# EAGLE board soundpuddle_megawing_mk1 (EAGLE 6.2)
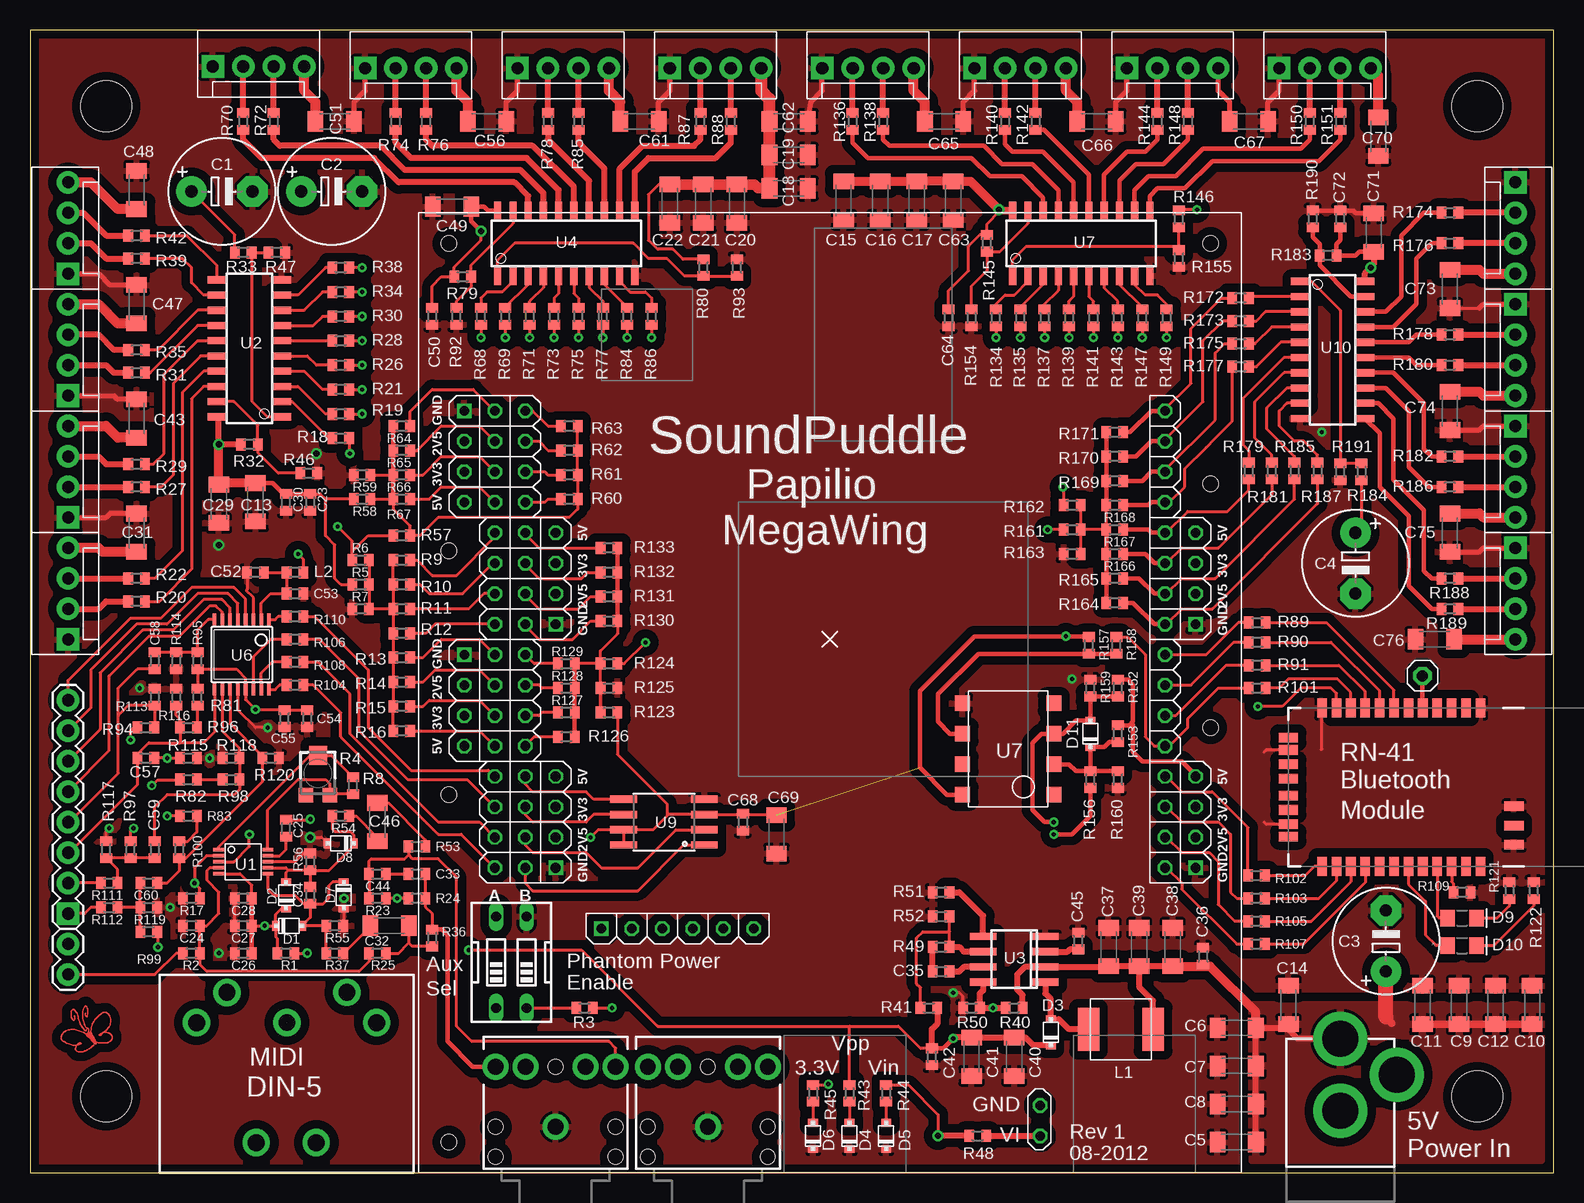
[diagram p3: board, top side]
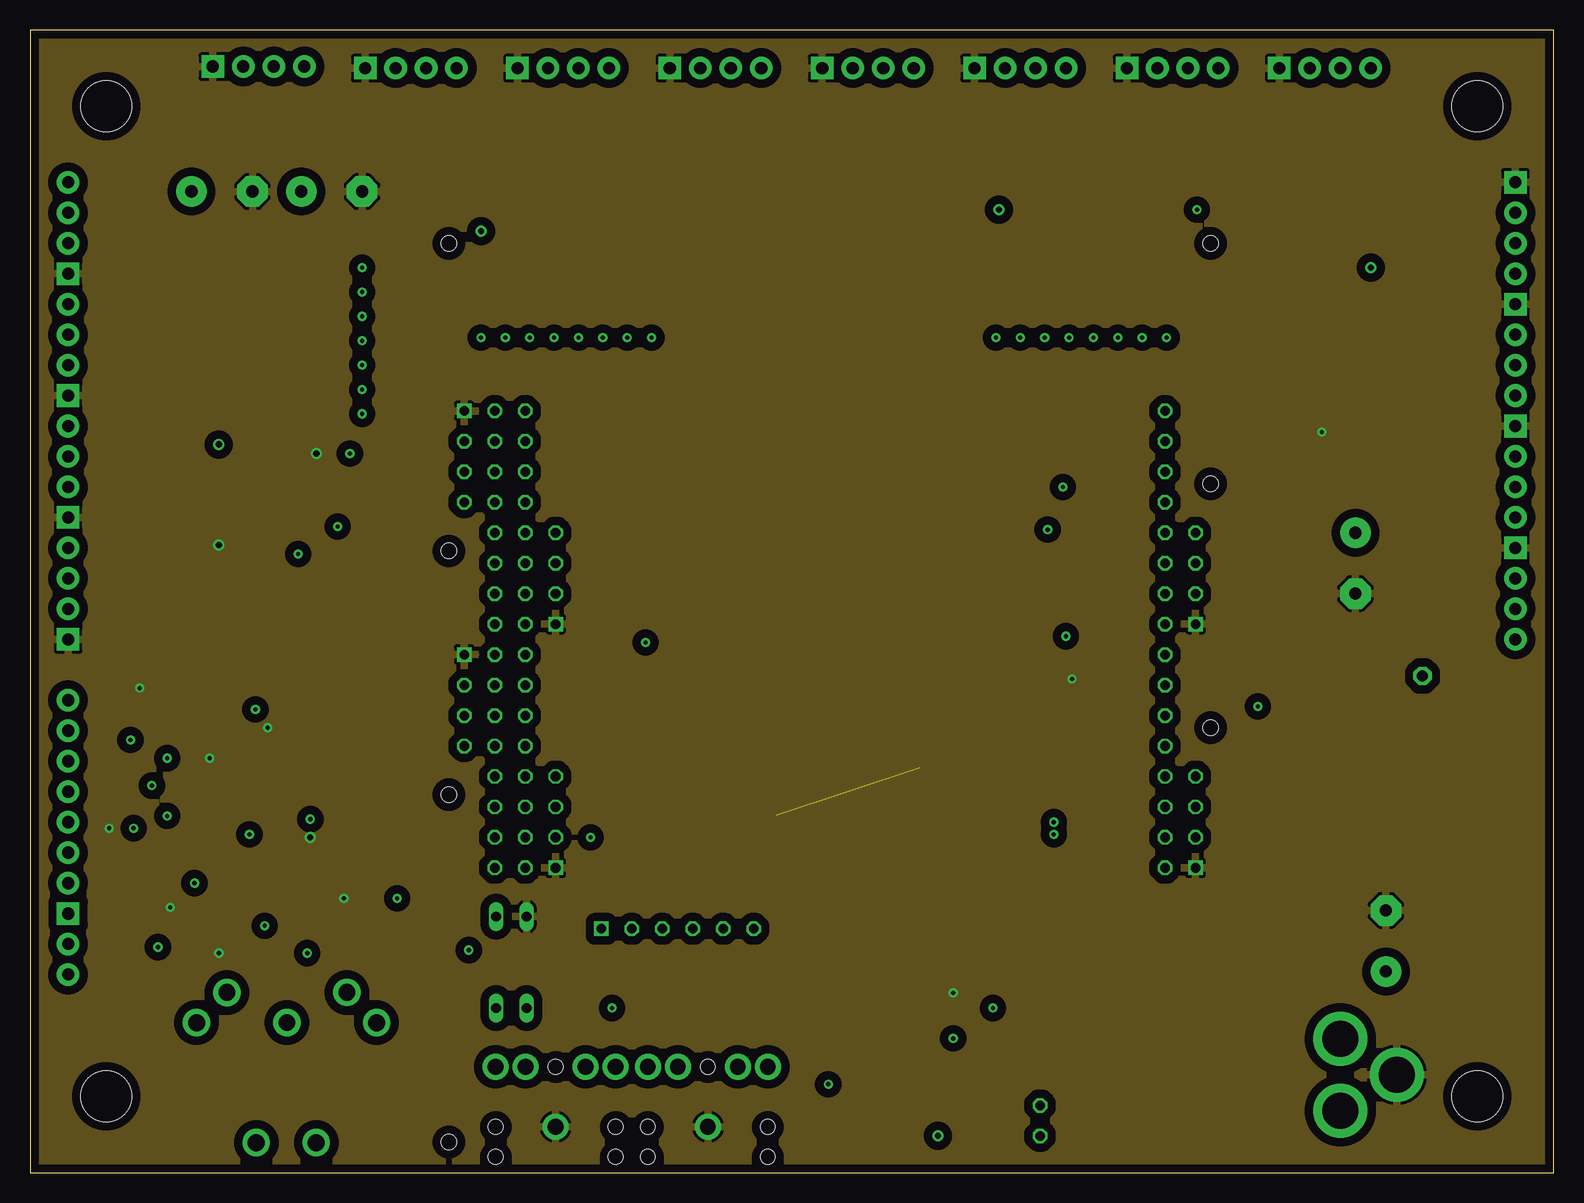
[diagram p4: board, inner layer Route2]
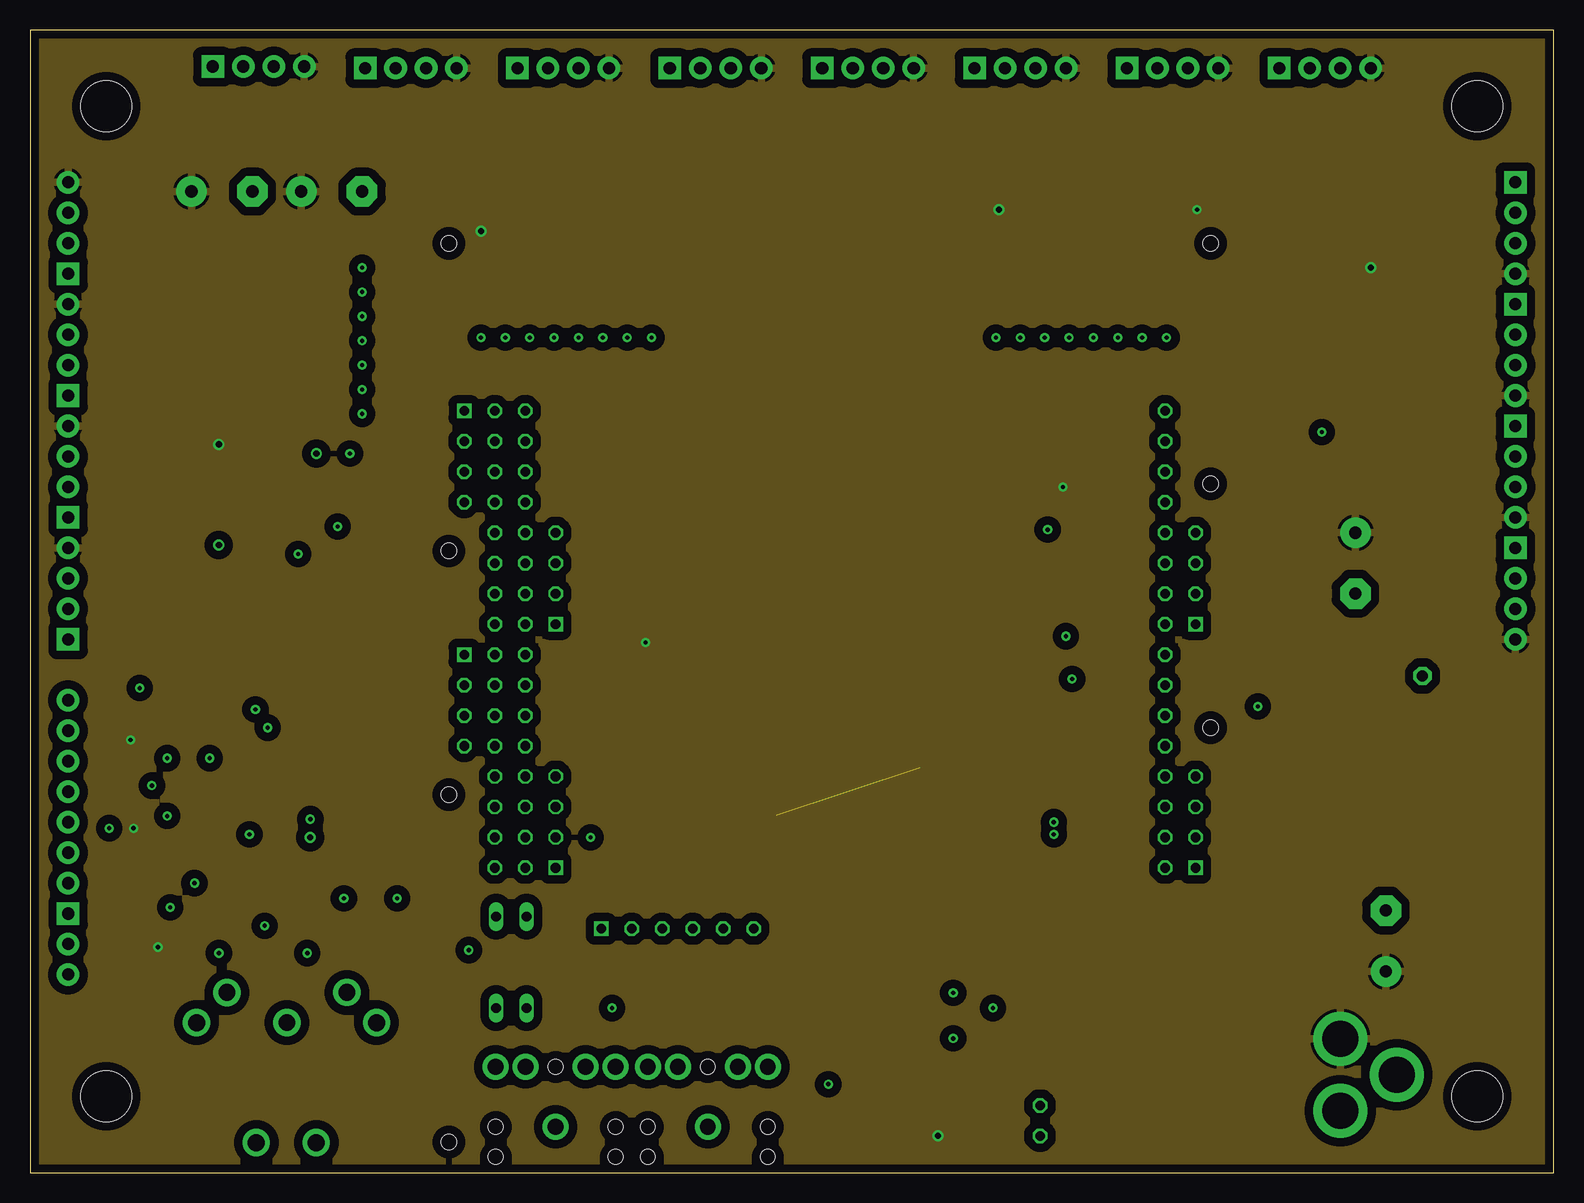
[diagram p5: board, inner layer Route15]
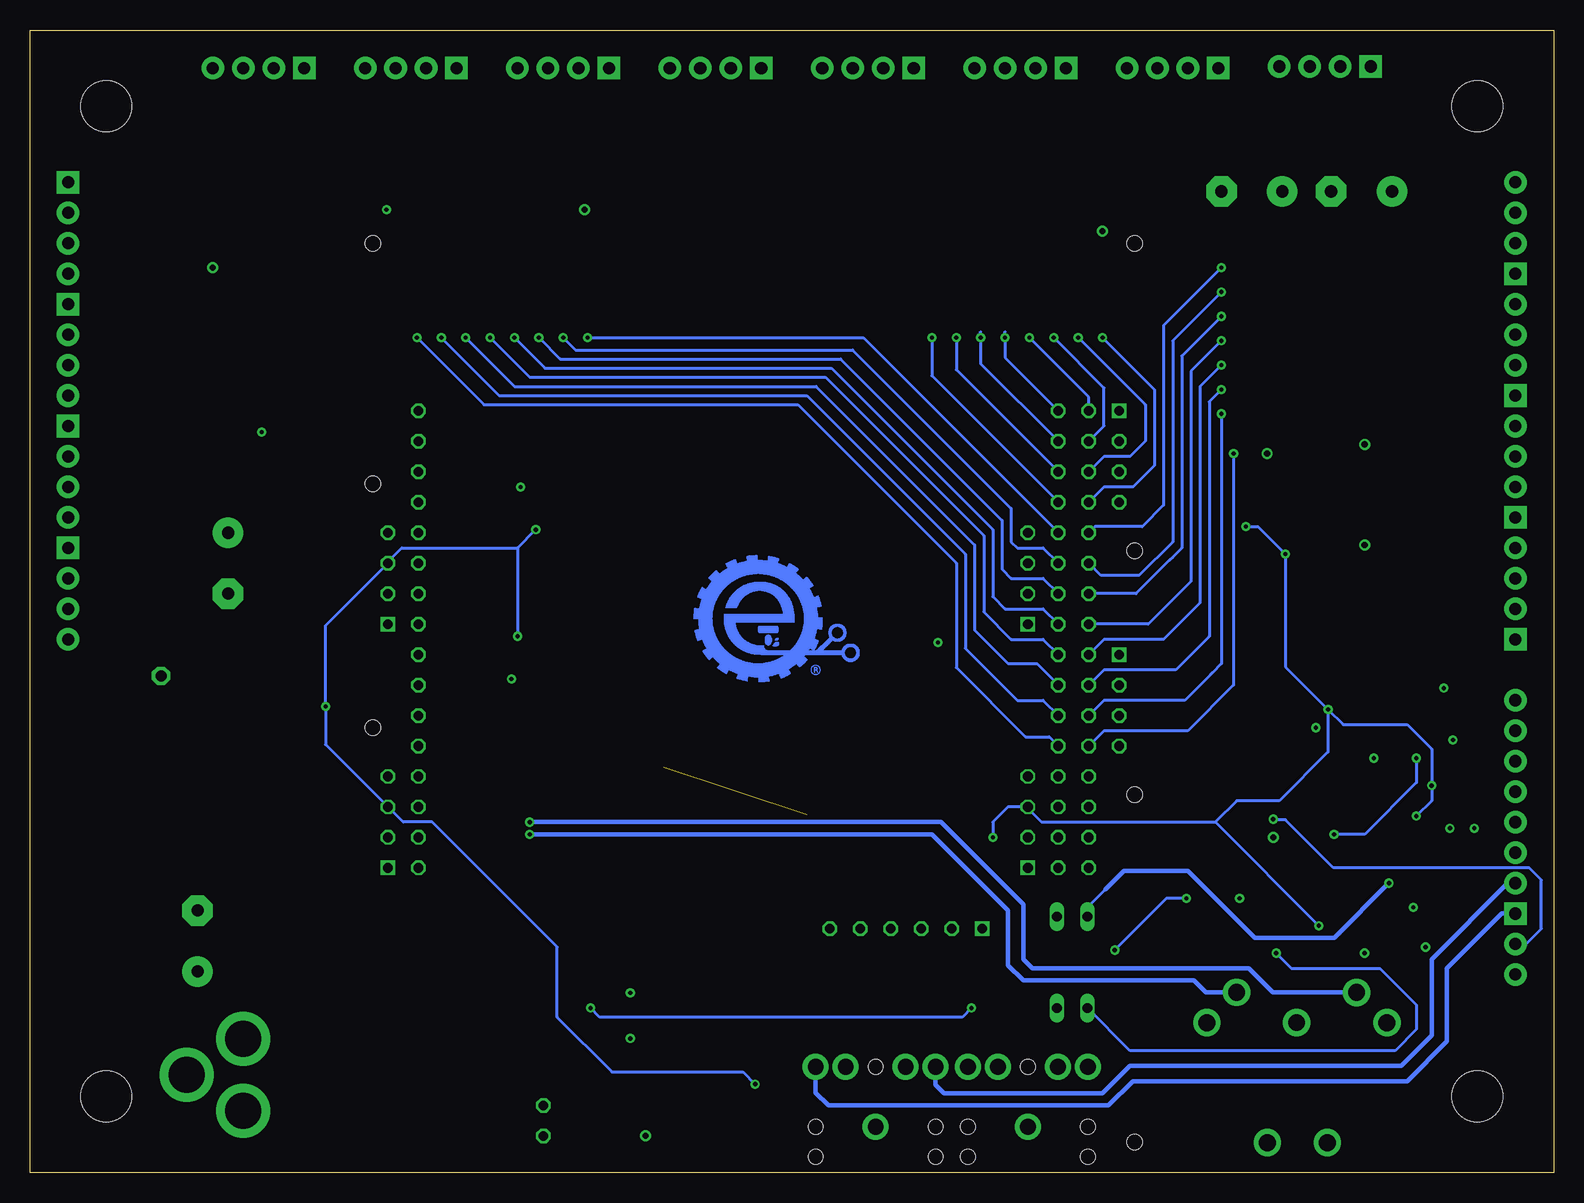
[diagram p6: board, bottom side, seen from below]

Size 127 x 95.25 mm. Coordinates in mm from the lower left corner, seen from the top.
Outline: 0,0 127,0 127,95.25 0,95.25 0,0
Copper layers (1+2*15+16): Top 0.0178mm / dielectric 12mil / Route2 0.0356mm / dielectric 28mil / Route15 0.0356mm / dielectric 12mil / Bottom 0.0178mm
Design rules: minimum track width 6mil, minimum drill 8mil, track to track 6mil, track to pad 6mil, pad to pad 6mil, via to via 6mil, smd to smd 6mil, copper to edge 20mil, drill to drill 16mil, minimum pad ring 8mil, minimum via ring 8mil, stop-mask expansion 3mil, vias tented up to drill 0mil, thermal gap 10mil
Holes 4.24 mm at 6.35,88.9 120.65,88.9 6.35,6.35 120.65,6.35

## Footprints (pad centres in the part's own frame; a part is rotated, then mirrored left to right if it is on the bottom)
E5-8,5 = drill 1.016 pad 2.54: + -2.54,0 | drill 1.016 pad 2.54 octagon: - 2.54,0
1206 = smd 1.3 x 1.7: P$1 -1.6,0; P$2 1.6,0
0603 = smd 0.8 x 1: 1 -0.7,0; 2 0.7,0
SOD-323 = smd 0.63 x 0.83: A 1.1,0; C -1.1,0
LED_0805 = smd 1.2 x 1.4: 1 -1.2,0; 2 1.2,0
POWER_JACK_PTH = drill 2.997 pad 4.318: GND 0,7.7; GNDBREAK 4.7,10.7; PWR 0,13.7
PAPILIO_PLUS = drill 0.8 octagon: A0 62.23,15.24; A1 62.23,17.78; A2 62.23,20.32; A3 62.23,22.86; A4 62.23,25.4; A5 62.23,27.94; A6 62.23,30.48; A7 62.23,33.02; A8 62.23,35.56; A9 62.23,38.1; A10 62.23,40.64; A11 62.23,43.18; A12 62.23,45.72; A13 62.23,48.26; A14 62.23,50.8; A15 62.23,53.34; B0 59.69,53.34; B1 59.69,50.8; B2 59.69,48.26; B3 59.69,45.72; B4 59.69,43.18; B5 59.69,40.64; B6 59.69,38.1; B7 59.69,35.56; B8 59.69,33.02; B9 59.69,30.48; B10 59.69,27.94; B11 59.69,25.4; B12 59.69,22.86; B13 59.69,20.32; B14 59.69,17.78; B15 59.69,15.24; C0 6.35,53.34; C1 6.35,50.8; C2 6.35,48.26; C3 6.35,45.72; C4 6.35,43.18; C5 6.35,40.64; C6 6.35,38.1; C7 6.35,35.56; C8 6.35,33.02; C9 6.35,30.48; C10 6.35,27.94; C11 6.35,25.4; C12 6.35,22.86; C13 6.35,20.32; C14 6.35,17.78; C15 6.35,15.24; GND 16.764,73.152; GND_2 50.8,58.42; TCK 48.26,58.42; TDI 43.18,58.42; TDO 45.72,58.42; TMS 40.64,58.42; VIN 16.764,75.692; W2_2V5 57.15,50.8; W2_2V5_2 64.77,38.1; W2_2V5_3 57.15,30.48; W2_2V5_4 64.77,17.78; W2_3V3 57.15,48.26; W2_3V3_2 64.77,40.64; W2_3V3_3 57.15,27.94; W2_3V3_4 64.77,20.32; W2_5V 57.15,45.72; W2_5V_2 64.77,43.18; W2_5V_3 57.15,25.4; W2_5V_4 64.77,22.86; W3_2V5 3.81,50.8; W3_2V5_2 3.81,30.48; W3_3V3 3.81,48.26; W3_3V3_2 3.81,27.94; W3_5V 3.81,45.72; W3_5V_2 3.81,25.4 | drill 0.8 square: REF 53.34,58.42; W2_GND 57.15,53.34; W2_GND_2 64.77,35.56; W2_GND_3 57.15,33.02; W2_GND_4 64.77,15.24; W3_GND 3.81,53.34; W3_GND_2 3.81,33.02 | hole 1.27: 66.04,76.2; 2.54,1.27; 66.04,1.27; 66.04,26.924; 66.04,47.244; 2.54,21.336; 2.54,41.656
1X02 = drill 1.016 pad 1.88: 1 0,0; 2 2.54,0
MOLEX-1X4 = drill 1.016 pad 1.88 square: 1 0,0 | drill 1.016 pad 1.88: 2 2.54,0; 3 5.08,0; 4 7.62,0
HEADER-SMALL-1PIN-0.036IN = drill 0.914 pad 1.524 octagon: P$1 0,0
AUDIO-JACK = drill 1.3 pad 2.184: RING 5,5; RSH 5,2.5; SLEEVE 0,0; TIP 5,-5; TSH 5,-2.5 | hole 1.2: 0,5; -2.5,5; -2.5,-5; 0,-5; 5,0
1X08 = drill 1.016 pad 1.88 square: 1 0,0 | drill 1.016 pad 1.88: 2 2.54,0; 3 5.08,0; 4 7.62,0; 5 10.16,0; 6 12.7,0; 7 15.24,0; 8 17.78,0
DIN_5_FEMALE_SUPPORT = drill 1.4 pad 2.286: 1 0.46,3.61; 2 -7.07,3.6; 3 7.94,3.6; 4 -4.53,6.12; 5 5.47,6.13; 6 -2.1,-6.4; 7 2.9,-6.4
INDUCTOR_10X10MM = smd 1.803 x 3.607: P$1 -2.692,0; P$2 2.692,0
TC33X = smd 1.2 x 1.2: 1 -1,-1.825; 3 1,-1.825 | smd 1.5 x 1.6: 2 0,1.5
DIPSWITCH-02 = drill 0.813 long: 1 -1.27,-3.81; 2 1.27,-3.81; 3 1.27,3.81; 4 -1.27,3.81
MSOP10 = smd 0.305 x 0.889: P$1 -1,-2.045; P$2 -0.5,-2.045; P$3 0,-2.045; P$4 0.5,-2.045; P$5 1,-2.045; P$6 1,2.045; P$7 0.5,2.045; P$8 0,2.045; P$9 -0.5,2.045; P$10 -1,2.045
SOIC-20 = smd 0.6 x 1.55: 1 -5.715,-2.7; 2 -4.445,-2.7; 3 -3.175,-2.7; 4 -1.905,-2.7; 5 -0.635,-2.7; 6 0.635,-2.7; 7 1.905,-2.7; 8 3.175,-2.7; 9 4.445,-2.7; 10 5.715,-2.7; 11 5.715,2.7; 12 4.445,2.7; 13 3.175,2.7; 14 1.905,2.7; 15 0.635,2.7; 16 -0.635,2.7; 17 -1.905,2.7; 18 -3.175,2.7; 19 -4.445,2.7; 20 -5.715,2.7
SO8 = smd 0.6 x 2.2: 1 -1.905,-2.6; 2 -0.635,-2.6; 3 0.635,-2.6; 4 1.905,-2.6; 5 1.905,2.6; 6 0.635,2.6; 7 -0.635,2.6; 8 -1.905,2.6
RN41 = smd 0.8 x 1.6: 1 -6.6,-6.6; 2 -5.4,-6.6; 3 -4.2,-6.6; 4 -3,-6.6; 5 -1.8,-6.6; 6 -0.6,-6.6; 7 0.6,-6.6; 8 1.8,-6.6; 9 3,-6.6; 10 4.2,-6.6; 11 5.4,-6.6; 12 6.6,-6.6; 13 6.6,6.6; 14 5.4,6.6; 15 4.2,6.6; 16 3,6.6; 17 1.8,6.6; 18 0.6,6.6; 19 -0.6,6.6; 20 -1.8,6.6; 21 -3,6.6; 22 -4.2,6.6; 23 -5.4,6.6; 24 -6.6,6.6 | smd 1.6 x 0.8: 25 -9.4,4.8; 26 -9.4,3.2; 27 -9.4,1.6; 28 9.4,3.1; 29 9.4,-3.1; 30 9.4,-4.122; 31 9.4,-1.9; 32 9.4,-0.7; 33 9.4,0.7; 34 9.4,1.9; 35 9.4,4.122
TSSOP16 = smd 0.305 x 0.991: 1 -2.275,-2.918; 2 -1.625,-2.918; 3 -0.975,-2.918; 4 -0.325,-2.918; 5 0.325,-2.918; 6 0.975,-2.918; 7 1.625,-2.918; 8 2.275,-2.918; 9 2.275,2.918; 10 1.625,2.918; 11 0.975,2.918; 12 0.325,2.918; 13 -0.325,2.918; 14 -0.975,2.918; 15 -1.625,2.918; 16 -2.275,2.918
SMD-8 = smd 1.27 x 1.27: P$1 -3.81,-3.81; P$2 -1.27,-3.81; P$3 1.27,-3.81; P$4 3.81,-3.81; P$5 3.81,3.81; P$6 1.27,3.81; P$7 -1.27,3.81; P$8 -3.81,3.81
SO08-EIAJ = smd 0.61 x 2.21: 1 -1.905,-3.378; 2 -0.635,-3.378; 3 0.635,-3.378; 4 1.905,-3.378; 5 1.905,3.353; 6 0.635,3.353; 7 -0.635,3.353; 8 -1.905,3.353

## Placement (x,y rotation side)
C1  1mF  [E5-8,5]  16,81.79 0 top
C2  1mF  [E5-8,5]  25.15,81.79 0 top
C3  1mF  [E5-8,5]  113.03,19.3 90 top
C4  1mF  [E5-8,5]  110.49,50.8 270 top
C5  47uF  [1206]  100.58,2.54 180 top
C6  47uF  [1206]  100.58,12.06 180 top
C7  47uF  [1206]  100.58,8.89 180 top
C8  47uF  [1206]  100.58,5.71 180 top
C9  47uF  [1206]  119.13,13.97 90 top
C10  47uF  [1206]  125.22,13.97 90 top
C11  47uF  [1206]  116.08,13.97 90 top
C12  47uF  [1206]  122.17,13.97 90 top
C13  47uF  [1206]  18.8,55.88 270 top
C14  47uF  [1206]  104.9,13.97 90 top
C15  47uF  [1206]  67.82,81.03 270 top
C16  47uF  [1206]  70.87,81.03 270 top
C17  47uF  [1206]  73.91,81.03 270 top
C18  47uF  [1206]  63.25,82.04 0 top
C19  47uF  [1206]  63.25,84.84 0 top
C20  47uF  [1206]  58.93,80.77 270 top
C21  47uF  [1206]  56.13,80.77 270 top
C22  47uF  [1206]  53.34,80.77 270 top
C23  0.1uF  [0603]  23.37,55.88 270 top
C24  470p  [0603]  13.46,20.57 180 top
C25  10uF  [0603]  21.34,28.7 270 top
C26  1uF  [0603]  17.78,18.29 180 top
C27  1uF  [0603]  17.78,20.57 180 top
C28  0.1uF  [0603]  17.78,22.86 180 top
C29  100uF  [1206]  15.75,55.75 270 top
C30  1uF  [0603]  21.34,55.88 270 top
C31  47uF  [1206]  8.89,53.34 270 top
C32  47uF  [1206]  29.97,20.57 180 top
C33  100p  [0603]  32.26,24.89 180 top
C34  470p  [0603]  23.37,23.11 90 top
C35  1uF  [0603]  75.95,16.76 180 top
C36  DNP  [0603]  97.79,18.03 90 top
C37  47uF  [1206]  89.92,18.8 90 top
C38  47uF  [1206]  95.25,18.8 90 top
C39  47uF  [1206]  92.46,18.8 90 top
C40  100uF  [1206]  82.04,9.65 270 top
C41  100uF  [1206]  78.49,9.65 270 top
C42  1uF  [0603]  75.18,9.65 270 top
C43  47uF  [1206]  8.89,62.87 270 top
C44  100p  [0603]  28.96,24.89 180 top
C45  1uF  [0603]  87.38,19.3 90 top
C46  47uF  [1206]  28.96,29.21 270 top
C47  47uF  [1206]  8.89,72.39 270 top
C48  47uF  [1206]  8.89,81.92 270 top
C49  100uF  [1206]  35.18,80.52 180 top
C50  1uF  [0603]  33.53,71.37 270 top
C51  47uF  [1206]  25.4,87.63 180 top
C52  0.1uF  [0603]  18.8,50.04 180 top
C53  1uF  [0603]  22.1,48.26 0 top
C54  0.1uF  [0603]  23.11,37.85 270 top
C55  1uF  [0603]  21.21,37.85 270 top
C56  47uF  [1206]  38.1,87.63 180 top
C57  10uF  [0603]  9.65,34.54 180 top
C58  1uF  [0603]  10.41,42.67 90 top
C59  10uF  [0603]  10.41,26.92 90 top
C60  10uF  [0603]  9.91,24.13 0 top
C61  47uF  [1206]  50.8,87.63 180 top
C62  47uF  [1206]  63.25,87.63 180 top
C63  100uF  [1206]  76.96,81.03 270 top
C64  1uF  [0603]  76.58,71.25 270 top
C65  47uF  [1206]  76.2,87.63 180 top
C66  47uF  [1206]  88.9,87.63 180 top
C67  47uF  [1206]  101.6,87.63 180 top
C68  1uF  [0603]  59.44,29.21 270 top
C69  DNP  [1206]  62.23,28.19 270 top
C70  47uF  [1206]  112.39,86.36 90 top
C71  100uF  [1206]  112.01,78.36 90 top
C72  1uF  [0603]  109.22,79.5 90 top
C73  47uF  [1206]  118.36,73.66 90 top
C74  47uF  [1206]  118.36,63.5 90 top
C75  47uF  [1206]  118.36,53.34 90 top
C76  47uF  [1206]  117.09,44.45 0 top
D1  [SOD-323]  21.59,20.57 0 top
D2  [SOD-323]  21.34,23.11 90 top
D3  [SOD-323]  85.09,11.68 90 top
D4  [SOD-323]  68.33,3.05 90 top
D5  [SOD-323]  71.37,3.05 90 top
D6  [SOD-323]  65.28,3.05 90 top
D7  [SOD-323]  26.16,23.11 270 top
D8  [SOD-323]  25.91,27.43 180 top
D9  [LED_0805]  119.38,21.21 0 top
D10  [LED_0805]  119.38,18.92 0 top
D11  [SOD-323]  88.39,36.58 90 top
J1  POWER_JACKPTH  [POWER_JACK_PTH]  109.22,-2.54 0 top
JP1  PAPILIO_PLUS_MEGAWING  [PAPILIO_PLUS]  100.97,78.74 180 top
JP2  [1X02]  3.17,19.05 270 top
JP3  [MOLEX-1X4]  3.17,44.45 90 top
JP4  HEADER-SMALL-1PIN  [HEADER-SMALL-1PIN-0.036IN]  116.08,41.4 0 top
JP5  AUDIO-JACK2PTH  [AUDIO-JACK]  43.81,3.81 90 top
JP6  [MOLEX-1X4]  3.17,54.61 90 top
JP7  [MOLEX-1X4]  3.17,64.77 90 top
JP8  [MOLEX-1X4]  3.17,74.93 90 top
JP9  [MOLEX-1X4]  15.24,92.2 0 top
JP10  [MOLEX-1X4]  27.94,92.08 0 top
JP11  [1X08]  3.17,21.59 90 top
JP12  [MOLEX-1X4]  40.64,92.08 0 top
JP13  [MOLEX-1X4]  53.34,92.08 0 top
JP14  AUDIO-JACK2PTH  [AUDIO-JACK]  56.52,3.81 90 top
JP15  [MOLEX-1X4]  66.04,92.08 0 top
JP16  [MOLEX-1X4]  78.74,92.08 0 top
JP17  MIDI_CONN_FEMALE_SUPPORT  [DIN_5_FEMALE_SUPPORT]  20.95,8.89 0 top
JP18  [MOLEX-1X4]  91.44,92.08 0 top
JP19  [MOLEX-1X4]  104.14,92.08 0 top
JP20  [MOLEX-1X4]  123.83,82.55 270 top
JP21  [MOLEX-1X4]  123.83,72.39 270 top
JP22  [MOLEX-1X4]  123.83,62.23 270 top
JP23  [MOLEX-1X4]  123.83,52.07 270 top
L1  330uH  [INDUCTOR_10X10MM]  90.93,11.94 180 top
L2  [0603]  22.1,50.04 180 top
LOGO1  LOGO  [LOGO]  72.39,40.39 0 bottom
R1  2.2K  [0603]  21.34,18.29 180 top
R2  2.2K  [0603]  13.46,18.29 0 top
R3  100  [0603]  46.23,13.72 0 top
R4  [TC33X]  24,33.27 0 top
R5  DNP  [0603]  27.56,49.02 0 top
R6  DNP  [0603]  27.56,51.05 0 top
R7  0  [0603]  27.56,46.99 0 top
R8  10K  [0603]  26.92,32.26 270 top
R9  2.2K  [0603]  30.99,51.05 0 top
R10  2.2K  [0603]  30.99,49.02 0 top
R11  2.2K  [0603]  30.99,46.99 0 top
R12  2.2K  [0603]  30.99,44.96 0 top
R13  2.2K  [0603]  30.99,42.93 0 top
R14  2.2K  [0603]  30.99,40.89 0 top
R15  2.2K  [0603]  30.99,38.86 0 top
R16  2.2K  [0603]  30.99,36.83 0 top
R17  10K  [0603]  13.46,22.86 0 top
R18  22  [0603]  25.91,61.21 180 top
R19  22  [0603]  25.91,63.25 180 top
R20  22  [0603]  8.89,47.62 180 top
R21  22  [0603]  25.91,65.28 180 top
R22  22  [0603]  8.89,49.53 180 top
R23  6.8K  [0603]  28.96,22.86 0 top
R24  6.8K  [0603]  32.26,22.86 180 top
R25  DNP  [0603]  28.96,18.29 180 top
R26  22  [0603]  25.91,67.31 180 top
R27  22  [0603]  8.89,57.15 180 top
R28  22  [0603]  25.91,69.34 180 top
R29  22  [0603]  8.89,59.05 180 top
R30  22  [0603]  25.91,71.37 180 top
R31  22  [0603]  8.89,66.67 180 top
R32  DNP  [0603]  18.29,60.71 180 top
R33  DNP  [0603]  17.78,76.71 180 top
R34  22  [0603]  25.91,73.41 180 top
R35  22  [0603]  8.89,68.58 180 top
R36  1K  [0603]  33.53,19.56 270 top
R37  10  [0603]  25.4,18.29 180 top
R38  22  [0603]  25.91,75.44 180 top
R39  22  [0603]  8.89,76.2 180 top
R40  2.2K  [0603]  82.04,13.72 0 top
R41  54.9K  [0603]  74.93,13.72 0 top
R42  22  [0603]  8.89,78.11 180 top
R43  10K  [0603]  68.33,6.6 90 top
R44  2.2K  [0603]  71.37,6.6 90 top
R45  2.2K  [0603]  65.28,6.6 90 top
R46  2.2K  [0603]  23.24,58.29 180 top
R47  2.2K  [0603]  20.57,76.71 180 top
R48  DNP  [0603]  78.99,3.05 0 top
R49  390  [0603]  75.95,18.8 0 top
R50  DNP  [0603]  78.49,13.72 0 top
R51  52.3K  [0603]  75.95,23.37 0 top
R52  1.47K  [0603]  75.95,21.34 0 top
R53  1K  [0603]  32.26,27.18 0 top
R54  10  [0603]  25.91,29.72 180 top
R55  1K  [0603]  25.4,20.57 180 top
R56  1K  [0603]  23.37,25.91 270 top
R57  0  [0603]  30.99,53.09 180 top
R58  DNP  [0603]  27.69,56.13 180 top
R59  DNP  [0603]  27.69,58.17 180 top
R60  2.2K  [0603]  44.96,56.13 0 top
R61  2.2K  [0603]  44.96,58.17 0 top
R62  2.2K  [0603]  44.96,60.2 0 top
R63  2.2K  [0603]  44.96,62.23 0 top
R64  2.2K  [0603]  30.99,62.23 180 top
R65  2.2K  [0603]  30.99,60.2 180 top
R66  2.2K  [0603]  30.99,58.17 180 top
R67  2.2K  [0603]  30.99,56.13 180 top
R68  22  [0603]  37.59,71.37 90 top
R69  22  [0603]  39.62,71.37 90 top
R70  22  [0603]  17.78,87.63 90 top
R71  22  [0603]  41.66,71.37 90 top
R72  22  [0603]  20.32,87.63 90 top
R73  22  [0603]  43.69,71.37 90 top
R74  22  [0603]  30.48,87.63 90 top
R75  22  [0603]  45.72,71.37 90 top
R76  22  [0603]  33.02,87.63 90 top
R77  22  [0603]  47.75,71.37 90 top
R78  22  [0603]  43.18,87.63 90 top
R79  DNP  [0603]  36.07,74.68 180 top
R80  DNP  [0603]  56.13,75.44 90 top
R81  DNP  [0603]  13.97,39.62 90 top
R82  100K  [0603]  13.21,32.77 180 top
R83  100K  [0603]  13.21,29.72 180 top
R84  22  [0603]  49.78,71.37 90 top
R85  22  [0603]  45.72,87.63 90 top
R86  22  [0603]  51.82,71.37 90 top
R87  22  [0603]  55.88,87.63 90 top
R88  22  [0603]  58.42,87.63 90 top
R89  10  [0603]  102.3,45.85 180 top
R90  10  [0603]  102.3,44.2 180 top
R91  10  [0603]  102.3,42.29 180 top
R92  2.2K  [0603]  35.56,71.37 90 top
R93  2.2K  [0603]  58.93,75.44 270 top
R94  DNP  [0603]  9.65,37.08 180 top
R95  DNP  [0603]  13.97,42.67 270 top
R96  DNP  [0603]  13.21,37.08 0 top
R97  DNP  [0603]  8.38,26.92 90 top
R98  10K  [0603]  16.76,32.77 180 top
R99  DNP  [0603]  9.91,20.07 0 top
R100  10K  [0603]  12.45,26.92 90 top
R101  10  [0603]  102.3,40.39 180 top
R102  10  [0603]  102.23,24.77 180 top
R103  10  [0603]  102.23,22.86 180 top
R104  50  [0603]  22.1,40.64 0 top
R105  10  [0603]  102.23,20.95 180 top
R106  50  [0603]  22.1,44.45 0 top
R107  10  [0603]  102.23,19.05 180 top
R108  50  [0603]  22.1,42.55 0 top
R109  330  [0603]  119.38,23.37 180 top
R110  50  [0603]  22.1,46.35 0 top
R111  10  [0603]  6.6,24.13 0 top
R112  10  [0603]  6.6,22.1 0 top
R113  DNP  [0603]  10.41,39.62 270 top
R114  DNP  [0603]  12.19,42.67 90 top
R115  DNP  [0603]  13.21,34.54 180 top
R116  DNP  [0603]  12.19,39.62 270 top
R117  DNP  [0603]  6.35,26.92 270 top
R118  100K  [0603]  16.76,34.54 0 top
R119  DNP  [0603]  9.91,22.1 180 top
R120  100K  [0603]  20.07,34.54 180 top
R121  330  [0603]  123.32,23.5 270 top
R122  330  [0603]  125.35,23.5 270 top
R123  0  [0603]  48.26,38.35 0 top
R124  DNP  [0603]  48.26,42.42 0 top
R125  DNP  [0603]  48.26,40.39 0 top
R126  2.2K  [0603]  44.7,36.32 0 top
R127  2.2K  [0603]  44.7,38.35 0 top
R128  2.2K  [0603]  44.7,40.39 0 top
R129  2.2K  [0603]  44.7,42.42 0 top
R130  2.2K  [0603]  48.26,45.97 0 top
R131  2.2K  [0603]  48.26,48.01 0 top
R132  2.2K  [0603]  48.26,50.04 0 top
R133  2.2K  [0603]  48.26,52.07 0 top
R134  22  [0603]  80.52,71.25 90 top
R135  22  [0603]  82.55,71.25 90 top
R136  22  [0603]  68.58,87.63 90 top
R137  22  [0603]  84.58,71.25 90 top
R138  22  [0603]  71.12,87.63 90 top
R139  22  [0603]  86.61,71.25 90 top
R140  22  [0603]  81.28,87.63 90 top
R141  22  [0603]  88.65,71.25 90 top
R142  22  [0603]  83.82,87.63 90 top
R143  22  [0603]  90.68,71.25 90 top
R144  22  [0603]  93.98,87.63 90 top
R145  DNP  [0603]  79.76,77.47 90 top
R146  DNP  [0603]  95.76,79.5 90 top
R147  22  [0603]  92.71,71.25 90 top
R148  22  [0603]  96.52,87.63 90 top
R149  22  [0603]  94.74,71.25 90 top
R150  22  [0603]  106.68,87.63 90 top
R151  22  [0603]  109.22,87.63 90 top
R152  330  [0603]  90.68,40.39 90 top
R153  330  [0603]  90.68,36.58 90 top
R154  2.2K  [0603]  78.49,71.25 90 top
R155  2.2K  [0603]  95.76,76.2 90 top
R156  220  [0603]  88.39,32.77 90 top
R157  220  [0603]  88.27,43.94 90 top
R158  390  [0603]  90.55,43.94 90 top
R159  330  [0603]  88.39,40.39 270 top
R160  330  [0603]  90.68,32.77 90 top
R161  0  [0603]  86.87,53.59 180 top
R162  DNP  [0603]  86.87,55.63 180 top
R163  DNP  [0603]  86.87,51.56 180 top
R164  100  [0603]  90.42,47.5 180 top
R165  100  [0603]  90.42,49.53 180 top
R166  100  [0603]  90.42,51.56 180 top
R167  100  [0603]  90.42,53.59 180 top
R168  100  [0603]  90.42,55.63 180 top
R169  100  [0603]  90.42,57.66 180 top
R170  100  [0603]  90.42,59.69 180 top
R171  100  [0603]  90.42,61.72 180 top
R172  22  [0603]  100.9,72.9 0 top
R173  22  [0603]  100.9,70.99 0 top
R174  100  [0603]  118.36,80.01 0 top
R175  22  [0603]  100.9,69.09 0 top
R176  100  [0603]  118.36,77.47 0 top
R177  22  [0603]  100.9,67.18 0 top
R178  100  [0603]  118.36,69.85 0 top
R179  100  [0603]  101.6,58.48 90 top
R180  100  [0603]  118.36,67.31 0 top
R181  100  [0603]  103.5,58.48 90 top
R182  100  [0603]  118.36,59.69 0 top
R183  DNP  [0603]  108.2,76.45 0 top
R184  DNP  [0603]  111,58.42 270 top
R185  100  [0603]  105.41,58.48 90 top
R186  100  [0603]  118.36,57.15 0 top
R187  100  [0603]  107.31,58.48 90 top
R188  100  [0603]  118.36,49.53 0 top
R189  100  [0603]  118.36,46.99 0 top
R190  2.2K  [0603]  106.93,79.5 270 top
R191  2.2K  [0603]  109.22,58.42 90 top
SW1  [DIPSWITCH-02]  40.13,17.53 0 top
U1  MAX4062  [MSOP10]  17.78,25.91 270 top
U2  SN74HCT541SOIC-20  [SOIC-20]  18.29,68.71 90 top
U3  LM5002  [SO8]  82.04,17.78 90 top
U4  SN74HCT541SOIC-20  [SOIC-20]  44.7,77.47 0 top
U5  BLUETOOTH-RN41"  [RN41]  114.3,32.13 180 top
U6  ADC128S102  [TSSOP16]  17.65,43.18 180 top
U7  SN74HCT541SOIC-20  [SOIC-20]  87.63,77.47 0 top
U8  6N138SMD8  [SMD-8]  81.53,35.31 90 top
U9  FLASH-SPI-25XXSMD1  [SO08-EIAJ]  52.83,29.21 90 top
U10  SN74HCT541SOIC-20  [SOIC-20]  108.58,68.58 270 top
U$4  [BUTTERFLY_LOGO_ON_COPPER]  4.83,11.43 0 top

## Tracks (layer width: path | path; a pad name or v marks a point on that pad's centre or on a via)
+3V3  (via drill 0.36)  (1 unrouted)
  Top 0.254: U9.7 U9.8 | 53.09,29.72 53.21,29.84 U9.3 59.37,29.84 C68.1 59.55,29.79 C69.P$1 | 53.09,29.72 51.94,28.57 U9.7 | U1.P$5 17.51,24.91 18.48,23.94 C28.1 | D1.C 20.49,19.64 20.64,19.5 R1.2 | C27.1 v19.56,20.57 D1.C | D1.C 20.49,21.51 21,22.01 D2.C | R57.2 28.19,53.09 26.86,51.75 R6.1 26.86,52.64 v25.65,53.85 | U9.7 47.37,28.57 v46.74,27.94 | C54.1 C55.1 18.86,38.55 v18.8,38.61 17.98,39.43 U6.13 17.98,41.2 17.21,41.97 R95.2 R81.2 | U5.11 108.9,39.94 108.46,40.39 105.92,40.39 104.39,38.86 v102.36,38.86 | R83.2 v11.43,29.72 | R161.2 v84.84,53.59 | L2.1 22.8,51.12 v22.35,51.56 | 12.45,32.7 10.61,32.7 v10.16,32.26 | R123.2 48.96,34.86 53.09,30.73 53.09,29.72 | R45.2 66.49,7.3 v66.55,7.37
  Top 0.381: C26.1 C27.1 C28.1 | U8.P$8 76.45,31.5 74.17,33.78 74.17,40.13 78.74,44.7 v86.36,44.7 88.2,44.7 R157.2 | 12.45,32.7 R82.2
  Bottom 0.254: v46.74,27.94 46.74,29.21 45.47,30.48 JP1.W2_3V3 43.81,30.35 42.67,29.21 28.19,29.21 | 86.36,52.07 96.01,52.07 97.16,50.93 JP1.W3_3V3_2 102.36,45.59 v102.36,38.86 102.36,35.69 JP1.W3_3V3 95.89,29.21 93.47,29.21 83.06,18.8 83.06,12.95 78.49,8.38 67.56,8.38 v66.55,7.37 | 86.36,52.07 v84.84,53.59 | v25.65,53.85 24.64,53.85 v22.35,51.56 22.35,42.16 v18.8,38.61 | v18.8,38.61 17.53,37.34 12.19,37.34 10.16,35.31 v10.16,32.26 10.16,30.99 v11.43,29.72 | 28.19,29.21 v19.56,20.57 | v18.8,38.61 18.8,35.05 22.86,30.99 26.42,30.99 28.19,29.21 | 86.36,52.07 v86.36,44.7
+5V
  Top 0.381: R152.2 91.5,41.09 91.95,40.64 91.95,37.59 91.82,37.47 | 91.82,37.47 91.63,37.28 R153.2 | JP1.W3_5V 97.16,33.15 96.01,34.29 92.71,34.29 91.95,35.05 91.95,37.34 91.82,37.47
A0  (via drill 0.36)
  Top 0.254: R73.1 v43.69,69.6 | R64.1 31.69,63.44 33.53,65.28 36.96,65.28 JP1.A0
  Bottom 0.254: JP1.A0 38.73,64.64 v43.69,69.6
A1  (via drill 0.36)
  Top 0.254: R71.1 v41.66,69.6 | R65.1 32.26,60.2 34.29,62.23 37.47,62.23 JP1.A1
  Bottom 0.254: JP1.A1 37.47,62.23 37.47,65.41 v41.66,69.6
A2  (via drill 0.36)
  Top 0.254: R69.1 v39.62,69.6 | R66.1 32.77,58.17 34.29,59.69 37.47,59.69 JP1.A2
  Bottom 0.254: JP1.A2 37.47,59.69 35.31,59.69 34.04,60.96 34.04,64.01 v39.62,69.6
A3  (via drill 0.36)
  Top 0.254: R68.1 v37.59,69.6 | R67.1 33.27,56.13 34.29,57.15 37.47,57.15 JP1.A3
  Bottom 0.254: JP1.A3 37.47,57.15 35.05,57.15 33.27,58.93 33.27,65.28 v37.59,69.6
A4  (via drill 0.36)
  Top 0.254: R9.2 32.26,51.05 33.53,49.78 35.56,49.78 38.73,52.96 JP1.A4 | v27.69,75.44 R38.1
  Bottom 0.254: JP1.A4 38.23,53.85 34.29,53.85 32.51,55.63 32.51,70.61 v27.69,75.44
A5  (via drill 0.36)
  Top 0.254: JP1.A5 38.61,50.8 36.07,48.26 33.27,48.26 32.51,49.02 R10.2 | v27.69,73.41 R34.1
  Bottom 0.254: JP1.A5 37.72,49.78 34.54,49.78 31.75,52.58 31.75,69.34 v27.69,73.41
A6  (via drill 0.36)
  Top 0.254: JP1.A6 37.85,48.26 36.58,46.99 R11.2 | v27.69,71.37 R30.1
  Bottom 0.254: JP1.A6 34.8,48.26 32,51.05 31.75,51.31 30.99,52.07 30.99,68.07 v27.69,71.37
A7  (via drill 0.36)
  Top 0.254: JP1.A7 33.78,45.72 33.02,44.96 R12.2 | R28.1 v27.69,69.34
  Bottom 0.254: JP1.A7 33.78,45.72 30.23,49.28 30.23,66.8 v27.69,69.34
A8  (via drill 0.36)
  Top 0.254: R13.2 32.77,42.93 34.29,44.45 37.47,44.45 JP1.A8 | R26.1 v27.69,67.31
  Bottom 0.254: JP1.A8 37.47,44.45 32.51,44.45 29.46,47.5 29.46,65.53 v27.69,67.31
A9  (via drill 0.36)
  Top 0.254: R14.2 32.77,40.89 33.78,41.91 37.47,41.91 JP1.A9 | R21.1 v27.69,65.28
  Bottom 0.254: JP1.A9 37.47,41.91 31.5,41.91 28.7,44.7 28.7,64.26 v27.69,65.28
A10  (via drill 0.36)
  Top 0.254: R15.2 32.77,38.86 33.27,39.37 37.47,39.37 JP1.A10 | R19.1 v27.69,63.25
  Bottom 0.254: JP1.A10 37.47,39.37 30.73,39.37 28.57,41.53 28.45,41.66 27.69,42.42 v27.69,63.25
A11  (via drill 0.36)
  Top 0.254: R16.2 37.47,36.83 JP1.A11 | R18.1 26.61,60.01 v26.67,59.94
  Bottom 0.254: JP1.A11 37.47,36.83 30.48,36.83 26.67,40.64 v26.67,59.94
ADC_CS
  Top 0.254: R110.2 23.75,46.35 28.19,41.91 28.19,37.08 31.75,33.53 38.23,33.53 JP1.A12
ADC_IN0
  Top 0.254: JP11.8 3.17,41.02 8.38,46.23 10.92,46.23 13.46,48.77 17.02,48.77 17.98,47.81 U6.4
ADC_IN1
  Top 0.254: U6.5 17.33,47.44 16.51,48.26 13.97,48.26 11.43,45.72 8.89,45.72 5.08,41.91 5.08,38.73 JP11.7
ADC_IN2
  Top 0.254: U6.6 16.68,47.08 16,47.75 14.48,47.75 11.94,45.21 9.4,45.21 5.84,41.66 5.84,36.96 JP11.6
ADC_IN3
  Top 0.254: U6.7 16.03,46.71 15.49,47.24 14.99,47.24 12.45,44.7 9.91,44.7 6.6,41.4 6.6,35.18 JP11.5
ADC_IN4
  Top 0.254: U6.8 14.86,46.1 13.97,45.21 R95.1 R114.2 C58.2
ADC_IN5
  Top 0.254: JP11.3 3.3,26.67 8.95,32.32 C57.2 8.95,34.86 9.91,35.81 12.51,35.81 | 12.51,35.81 R96.1 12.51,37.78 12.19,38.1 R116.2 | U6.9 15.38,36.71 14.48,35.81 12.51,35.81
ADC_IN6
  Top 0.254: U6.10 16.03,36.8 17.46,35.37 R118.2 R98.1 17.46,31.94 17.02,31.5 11.43,31.5 10.41,30.48 C59.2
ADC_IN7
  Top 0.254: U6.11 16.68,37.42 19.37,34.74 R120.2 19.37,32.57 13.02,26.22 R100.1 12.45,25.15 11.43,24.13 C60.2
ADC_MISO
  Top 0.254: R108.2 24,42.55 26.67,39.88 26.67,36.58 34.04,29.21 37.47,29.21 JP1.A14
ADC_MOSI
  Top 0.254: R106.2 24.13,44.45 27.43,41.15 27.43,36.83 31.5,32.77 36.45,32.77 JP1.A13
ADC_SCK
  Top 0.254: R104.2 23.62,40.64 25.91,38.35 25.91,36.32 34.04,28.19 35.94,28.19 JP1.A15
AIN_4
  Top 0.254: C58.1 8.95,41.97 7.37,40.39 7.37,38.1 | R113.2 10.35,38.92 | JP11.4 3.3,29.21 7.37,33.27 7.37,38.1 | R113.2 8.19,38.92 7.37,38.1 | R113.2 10.41,37.15 R94.1
AUX_SEL  (via drill 0.36)
  Top 0.254: U1.P$2 14.72,26.41 13.72,25.4 v13.72,24.13 14.16,23.68 R17.2
  Bottom 0.254: SW1.4 38.86,22.1 37.34,23.62
  Bottom 0.381: 37.34,23.62 35.81,25.15 30.48,25.15 24.89,19.56 18.29,19.56 v13.72,24.13
B4  (via drill 0.36)
  Top 0.254: R126.1 42.04,36.32 JP1.B4 | R149.1 v94.74,69.6
  Bottom 0.254: v94.74,69.6 89.15,64.01 62.99,64.01 49.78,50.8 49.78,42.1 R126.1 42.04,36.32 JP1.B4
B5  (via drill 0.36)
  Top 0.254: R127.1 42.67,38.35 42.42,38.1 JP1.B5 | R147.1 v92.71,69.6
  Bottom 0.254: v92.71,69.6 87.88,64.77 62.23,64.77 49.02,51.56 49.02,43.69 44.7,39.37 42.55,39.37 JP1.B5
B6  (via drill 0.36)
  Top 0.254: R128.1 42.67,40.39 42.42,40.64 JP1.B6 | R143.1 v90.68,69.6
  Bottom 0.254: v90.68,69.6 86.61,65.53 61.47,65.53 48.26,52.32 48.26,45.21 45.47,42.42 43.05,42.42 JP1.B6
B7  (via drill 0.36)
  Top 0.254: R129.1 42.04,42.42 JP1.B7 | R141.1 v88.65,69.6
  Bottom 0.254: v88.65,69.6 85.34,66.29 60.71,66.29 47.5,53.09 47.5,46.74 45.21,44.45 42.55,44.45 JP1.B7
B8  (via drill 0.36)
  Top 0.254: JP1.B8 41.27,45.59 42.42,44.45 45.21,44.45 46.74,45.97 R130.1 | R139.1 v86.61,69.6
  Bottom 0.254: v86.61,69.6 84.07,67.06 60.2,67.06 46.74,53.59 46.74,48.01 45.72,46.99 42.55,46.99 JP1.B8
B9  (via drill 0.36)
  Top 0.254: JP1.B9 41.27,48.13 42.42,46.99 45.72,46.99 46.74,48.01 R131.1 | R137.1 v84.58,69.6
  Bottom 0.254: v84.58,69.6 82.8,67.82 59.44,67.82 45.97,54.36 45.97,50.29 45.21,49.53 42.55,49.53 JP1.B9
B10  (via drill 0.36)
  Top 0.254: JP1.B10 41.27,50.67 42.42,49.53 45.97,49.53 46.48,50.04 R132.1 | R135.1 v82.55,69.6
  Bottom 0.254: v82.55,69.6 81.53,68.58 58.42,68.58 45.21,55.37 45.21,52.58 44.7,52.07 42.55,52.07 JP1.B10
B11  (via drill 0.36)
  Top 0.254: JP1.B11 41.27,53.21 42.42,52.07 R133.1 | R134.1 v80.52,69.6
  Bottom 0.254: v80.52,69.6 57.53,69.6 JP1.B11
B12  (via drill 0.36)
  Top 0.254: R86.1 v51.82,69.6 | JP1.B12 42.93,55.88 43.18,56.13 R60.1
  Bottom 0.254: v51.82,69.6 51.82,66.42 JP1.B12
B13  (via drill 0.36)
  Top 0.254: R84.1 v49.78,69.6 | JP1.B13 42.93,58.42 43.18,58.17 R61.1
  Bottom 0.254: v49.78,69.6 49.78,66.93 JP1.B13
B14  (via drill 0.36)
  Top 0.254: R77.1 v47.75,69.6 | JP1.B14 42.42,60.96 43.18,60.2 R62.1
  Bottom 0.254: 47.75,70.1 v47.75,69.6 47.75,67.44 JP1.B14
B15  (via drill 0.36)
  Top 0.254: R75.1 v45.72,69.6 | JP1.B15 41.91,63.5 43.18,62.23 R63.1
  Bottom 0.254: 45.72,70.1 v45.72,69.6 45.72,67.94 JP1.B15
C0
  Top 0.254: JP1.C0 94.74,25.4 96.01,24.13 96.01,23.62 100.58,19.05 R107.2
C1
  Top 0.254: JP1.C1 94.74,27.94 96.01,26.67 98.3,26.67 99.06,25.91 99.06,22.35 100.46,20.95 R105.2
C2
  Top 0.254: JP1.C2 94.74,30.48 96.01,29.21 99.06,29.21 100.08,28.19 100.08,23.37 100.58,22.86 R103.2
C3
  Top 0.254: JP1.C3 94.74,33.02 96.01,31.75 98.55,31.75 101.53,28.77 R102.2
C4
  Top 0.254: R101.2 99.06,40.39 96.52,37.85 96.52,37.08 95,35.56 JP1.C4 93.73,35.56 92.96,36.32 92.96,43.18 91.5,44.64 R158.2
C5
  Top 0.254: JP1.C5 95.5,38.1 99.69,42.29 R91.2
C6
  Top 0.254: JP1.C6 96.77,40.64 100.33,44.2 R90.2
C7
  Top 0.254: JP1.C7 98.04,43.18 100.71,45.85 R89.2
C8
  Top 0.254: JP1.C8 94.74,45.72 96.01,46.99 98.55,46.99 107.31,55.75 R187.1
  Top 0.381: R164.1 91.95,47.5 93.73,45.72 JP1.C8
C9
  Top 0.254: JP1.C9 94.74,48.26 96.01,49.53 98.81,49.53 105.41,56.13 R185.1
  Top 0.381: R165.1 92.46,49.53 93.73,48.26 JP1.C9
C10
  Top 0.254: JP1.C10 94.74,50.8 96.01,52.07 99.06,52.07 103.5,56.52 R181.1
  Top 0.381: R166.1 92.96,51.56 93.73,50.8 JP1.C10
C11
  Top 0.254: JP1.C11 94.74,53.34 96.52,55.12 99.82,55.12 101.6,56.9 R179.1
  Top 0.381: R167.1 93.22,53.59 93.47,53.34 JP1.C11
C12
  Top 0.254: JP1.C12 95,55.88 96.27,57.15 96.27,58.67 98.04,60.45 98.81,61.21 100.2,62.61 R177.1
  Top 0.381: R168.1 93.22,55.63 93.47,55.88 JP1.C12
C13
  Top 0.254: JP1.C13 94.61,58.55 98.81,62.74 98.81,68.33 99.57,69.09 R175.1
  Top 0.381: R169.1 92.71,57.66 93.47,58.42 JP1.C13
C14
  Top 0.254: JP1.C14 94.61,61.09 97.79,64.26 97.79,69.34 99.44,70.99 R173.1
  Top 0.381: R170.1 92.2,59.69 93.47,60.96 JP1.C14
C15
  Top 0.254: JP1.C15 94.61,63.63 96.77,65.79 96.77,70.36 99.31,72.9 R172.1 99.82,72.9
  Top 0.381: R171.1 91.69,61.72 93.47,63.5 JP1.C15
FLASH_CS
  Top 0.254: JP1.B0 41.27,24.13 41.91,23.5 50.67,23.5 54.48,27.3 U9.1
FLASH_MISO
  Top 0.254: JP1.B1 41.27,27.3 41.91,26.67 46.35,26.67 47.62,25.4 50.67,25.4 53.85,28.57 U9.2
FLASH_MOSI
  Top 0.254: U9.5 46.99,31.11 46.35,31.75 41.91,31.75 41.27,32.38 JP1.B3
FLASH_SCK
  Top 0.254: U9.6 46.99,29.84 46.35,29.21 41.91,29.21 41.27,29.84 JP1.B2
GND  (via drill 0.36, 0.51)
  Top 0.254: C73.P$1 120.83,72.06 | R56.1 22.8,26.61 22.1,25.91 U1.P$8 | D7.A 26.16,20.64 R55.1 | R50.1 77.79,14.67 77.47,14.99 v76.96,14.99 | 107.62,35.23 107.7,35.31 U5.12 | v23.37,27.94 24.3,27.94 D8.A | U6.3 18.63,47.92 18.03,48.51 18.1,48.58 C52.2 | R117.1 6.35,28.45 v6.6,28.7 | U6.12 17.33,38.55 18.8,37.08 v19.81,37.08 | C27.2 C28.2 | U5.28 103.05,29.03 102.87,29.21 | U5.29 103.05,35.23 102.87,35.05
  Top 0.381: R190.1 C72.2 110.3,80.2 110.54,79.96 C71.P$2
  Top 0.406: C67.P$1 103.2,89.23 104.14,90.17 JP19.1 | C66.P$1 90.5,89.23 91.44,90.17 JP18.1 | C65.P$1 77.8,89.23 78.74,90.17 JP16.1 | C62.P$1 65.1,89.23 66.04,90.17 JP15.1 | C61.P$1 52.4,89.23 53.34,90.17 JP13.1 | C56.P$1 39.7,89.23 40.64,90.17 JP12.1 | C51.P$1 27,89.23 27.94,90.17 JP10.1 | C31.P$1 6.68,54.94 6.35,54.61 JP6.1 | JP7.1 6.99,64.77 7.29,64.47 C43.P$1 | JP8.1 5.71,74.93 6.66,73.99 C47.P$1 | 120.83,72.06 121.16,72.39 JP21.1 | C74.P$1 120.83,61.9 121.16,62.23 JP22.1 | C75.P$1 120.83,51.74 121.16,52.07 JP23.1
  other vias: 23.88,59.94 15.75,52.32 26.16,22.86 86.87,41.15 9.14,40.39 15.75,18.29 11.68,22.1 14.99,34.54 107.7,61.72
  pour Route2 (isolate 0.711): 0.64,94.49 126.49,94.49 126.49,0.64 0.64,0.64
  pour Top (isolate 0.711, rank 5): 0.64,94.49 126.49,94.49 126.49,0.64 0.64,0.64
LM5002_EN  (via drill 0.36)
  Top 0.254: R3.2 v48.51,13.72
  Top 0.508: U3.8 79.44,15.18 79.19,14.92 R50.2 v80.26,13.72 R40.1
  Bottom 0.254: v48.51,13.72 49.28,12.95 79.5,12.95 v80.26,13.72
MAX4062_OUT  (via drill 0.36)
  Top 0.254: C57.1 v11.43,34.54 R115.2 | U1.P$3 17.02,25.91 18.29,27.18 v18.29,28.19
  Bottom 0.254: v11.43,34.54 11.43,32.51 15.75,28.19 v18.29,28.19
N$1
  Top 0.254: U6.2 19.28,47.47 20.07,48.26 C53.1 L2.2 C52.1
N$2
  Top 0.254: R107.1 106.17,19.05 111.3,24.18 U5.16
N$3
  Top 0.254: JP2.2 10.41,16.51 12.19,18.29 R2.1
N$4  (via drill 0.36)
  Top 0.254: C25.1 23.31,29.4 v23.37,29.46
  Bottom 0.254: JP2.1 2.29,19.05 1.02,20.32 1.02,24.38 2.03,25.4 18.35,25.4 22.35,29.4 23.31,29.4 v23.37,29.46
N$5
  Top 0.254: R105.1 106.81,20.95 110.1,24.25 U5.15
N$6
  Top 0.254: R103.1 107.44,22.86 108.9,24.32 U5.14
N$7
  Top 0.254: C46.P$1 29.9,30.81 32.96,27.75 R53.2
N$8
  Top 0.254: R23.1 C44.2 28.26,25.97 28.45,26.16 31.24,26.16 31.56,26.48 | JP5.TIP 48.81,10.37 48.26,10.92 36.83,10.92 35.56,12.19 35.56,24.64 34.04,26.16 31.87,26.16 31.56,26.48 | R53.1 31.56,26.48
N$9
  Top 0.254: C44.1 C33.2
N$10
  Top 0.254: R25.1 30.73,18.29 31.57,19.13 | C32.P$1 31.57,19.13 | R36.2 31.84,18.86 31.57,19.13
N$11
  Top 0.254: R102.1 106.3,24.77 107.06,25.53 U5.13
N$12
  Top 0.254: U6.16 20.45,40.26 20.83,40.64 R104.1
N$13
  Top 0.254: U6.14 18.63,43.01 20.07,44.45 R106.1
N$14
  Top 0.254: U6.1 20.44,46.1 20.7,46.35 R110.1
N$15
  Top 0.254: U6.15 19.28,41.63 20.19,42.55 R108.1
N$16
  Top 0.254: D9.2 122.3,21.21 123.32,22.23 R121.2
N$17
  Top 0.254: D10.2 122.05,18.92 125.35,22.23 R122.2
N$18
  Top 0.254: U5.19 114.9,24.04 116.33,22.61 116.33,19.81 117.22,18.92 D10.1
N$19
  Top 0.254: U5.21 117.3,21.38 117.47,21.21 D9.1
N$20
  Top 0.508: U3.1 84.64,14.93 85.09,14.48 D3.A 85.77,12.78 86.61,11.94 L1.P$2
N$21
  Top 0.254: U5.22 118.5,24.25 118.68,24.07 R109.2
N$22
  Top 0.508: JP20.3 R176.2
N$23  (via drill 0.36)
  Top 0.254: R1.1 v23.11,18.29
  Bottom 0.254: v23.11,18.29 21.84,17.02 14.48,17.02 11.43,13.97 11.43,11.94 13.21,10.16 35.31,10.16 SW1.1
N$24
  Top 0.254: U2.1 19.81,62.99 18.48,64.32 R33.1 R47.2
N$26
  Top 0.254: R9.1 R10.1 R11.1 | R16.1 R15.1 R14.1 R13.1 R12.1 R11.1 | R6.2 R5.2 R7.2 R11.1
N$27
  Top 0.254: R37.1 26.16,18.29 28.26,20.38 28.26,20.46 C32.P$2
N$28
  Top 0.254: R54.1 27.18,29.72 28.96,27.94 C46.P$2
N$29
  Top 0.254: R43.1 D4.A
N$30
  Top 0.254: R44.1 D5.A
N$31
  Top 0.254: R96.2 13.97,37.15 R81.1
N$32
  Top 0.254: R82.1 R98.2
N$33
  Top 0.254: R111.1 JP11.2
  Bottom 0.381: JP11.2 3.81,24.13 10.16,17.78 10.16,11.43 12.7,8.89 35.31,8.89 37.59,6.6 50.8,6.6 51.52,7.32 JP14.RING
N$34
  Top 0.254: R83.1 13.91,28.39 13.15,27.62 R100.2
N$35
  Top 0.254: R112.1 5.08,22.1 4.57,21.59 JP11.1
  Bottom 0.381: JP11.1 4.32,21.59 8.89,17.02 8.89,10.92 12.19,7.62 35.05,7.62 37.08,5.59 60.45,5.59 61.52,6.65 JP14.TIP
N$36
  Top 0.254: R99.1 R119.2 | R119.2 R112.2 | R119.2 C60.1
N$37
  Top 0.254: C59.1 R97.1 R117.2 7.3,25.27 R111.2
N$38
  Top 0.254: SW1.2 R3.1
N$39
  Top 0.508: 79.76,3.05 84.07,3.05
N$40
  Top 0.254: R162.1 R161.1 | R161.1 R163.1 | R161.1 R167.2 R168.2
  Top 0.381: R171.2 R170.2 R169.2 R168.2 | R167.2 R166.2 R165.2 R164.2
N$41
  Top 0.254: U5.10 110.1,40.01 108.97,41.15 104.9,41.15 104.14,40.39 R101.1
N$42
  Top 0.254: R45.1 D6.A
N$43
  Top 0.254: R92.2 35.56,72.64 36.77,73.85 R79.1 36.77,75.63 40.26,79.12 U4.19
N$44
  Top 0.254: U7.19 83.19,79.12 80.83,76.77 R145.1 79.76,75.18 78.49,73.91 R154.2
N$45
  Top 0.254: U10.1 106.81,74.3 109.22,71.88 R191.2 R184.1
N$46
  Top 0.254: R91.1 109.09,42.29 111.25,40.13 111.25,38.78 U5.9
N$47
  Top 0.254: U5.8 112.5,40.15 108.46,44.2 R90.1
N$48
  Top 0.254: U5.7 113.7,40.22 108.08,45.85 R89.1
N$49
  Top 0.381: R190.2 106.93,77.98 107.5,77.41 R183.1 107.5,75.63 110.11,73.03 U10.19
N$50
  Top 0.381: U5.5 116.08,38.73 JP4.P$1
N$53  (via drill 0.36)
  Top 0.381: R156.1 88.39,29.72 86.87,28.19 v85.34,28.19
  Bottom 0.381: v85.34,28.19 51.82,28.19 45.47,21.84 45.47,17.27 44.2,16 29.97,16 28.99,15.02 JP17.5
N$54
  Top 0.381: R156.2 D11.C 89.58,35.48 89.98,35.88 R153.1 | R156.2 R160.2 | U8.P$2 86.61,34.04 87.18,33.47 R156.2
N$55  (via drill 0.36)
  Top 0.381: R152.1 R159.2 D11.A 87.21,37.68 86.11,36.58 U8.P$3 84.33,36.58 83.57,35.81 83.57,30.23 84.58,29.21 v85.34,29.21
  Bottom 0.381: JP17.4 23.39,15.01 25.4,17.02 43.43,17.02 44.2,17.78 44.2,22.35 51.05,29.21 v85.34,29.21
N$56
  Top 0.254: R46.2 20.7,58.29 18.99,60.01 R32.1 18.99,62.29 17.02,64.26 U2.19
N$57
  Top 0.254: U2.3 22.35,65.53 24.64,63.25 R19.2
N$58
  Top 0.254: U2.5 23.11,68.07 23.88,67.31 R26.2
N$59
  Top 0.254: U2.2 21.84,64.26 24.89,61.21 R18.2
N$60
  Top 0.381: R158.1 R157.1 79.06,43.24 75.69,39.88 75.69,37.59 76.71,36.58 U8.P$6
N$64
  Top 0.254: U2.4 22.86,66.8 24.38,65.28 R21.2
N$68
  Top 0.254: U2.6 R28.2 25.27,69.34
N$72
  Top 0.254: U2.7 23.62,70.61 24.38,71.37 R30.2
N$73
  Top 0.254: U2.8 22.86,71.88 24.38,73.41 R34.2
N$74
  Top 0.254: R38.2 24.64,75.44 22.35,73.15 U2.9
N$76
  Top 0.254: R31.1 10.03,66.67 13.97,70.61 U2.14
N$77
  Top 0.254: U2.18 14.48,65.53 13.46,64.52 13.46,50.29 10.79,47.62 R20.1
N$78
  Top 0.254: U2.17 14.48,66.8 12.7,65.02 12.7,51.82 10.41,49.53 R22.1
N$79
  Top 0.254: U2.16 14.22,68.07 11.94,65.79 11.94,58.17 10.92,57.15 R27.1
N$80
  Top 0.254: R29.1 10.29,59.05 11.18,59.94 11.18,66.55 13.97,69.34 U2.15
N$81
  Top 0.254: U2.13 13.97,71.88 10.67,68.58 R35.1
N$82
  Top 0.254: U2.12 14.48,73.15 13.46,74.17 13.46,75.44 12.7,76.2 R39.1
N$83
  Top 0.254: R42.1 13.08,78.11 15.59,75.6 U2.11
N$84
  Top 0.508: JP7.2 6.35,67.31 6.99,66.67 R31.2
N$85
  Top 0.508: R35.2 6.99,68.58 5.71,69.85 JP7.3
N$86
  Top 0.508: JP8.2 5.08,77.47 6.35,76.2 R39.2
N$87
  Top 0.508: JP8.3 4.45,80.01 6.35,78.11 R42.2
N$88
  Top 0.508: JP6.3 5.71,59.69 6.35,59.05 R29.2
N$89
  Top 0.508: JP6.2 R27.2
N$90
  Top 0.508: JP3.3 R22.2
N$91
  Top 0.508: JP3.2 5.71,46.99 6.35,47.62 R20.2
N$94
  Top 0.508: R87.2 JP13.2
N$95
  Top 0.508: R51.2 77.47,23.37 79.44,21.4 U3.5
N$96
  Top 0.508: U3.3 86.49,18.41 86.68,18.6 C45.1
N$97
  Top 0.508: C35.1 77.47,16.76 77.85,17.14 U3.7
N$98
  Top 0.254: R41.1 74.23,15.43 73.91,15.75 73.91,19.56 74.42,20.07 76.65,20.07 | R49.2 76.65,20.07 | 76.65,20.07 R52.2
  Top 0.508: U3.6 77.85,18.41 77.47,18.8 R49.2
N$100
  Top 0.508: C35.2 R49.1
N$101
  Top 0.254: R56.2 C34.2 | R56.2 21.53,25.21 | 21.53,25.21 21.33,25.41 U1.P$7 | R56.2 24.95,25.21 27.01,27.26 D8.C 27.01,28.11 26.67,28.45 25.4,28.45 25.21,28.64 R54.2 | D2.A 21.34,25.02 21.53,25.21
N$102
  Top 0.254: U1.P$9 20.82,26.41 21.34,26.92 C25.2
N$104
  Top 0.254: 38.9,74.68 U4.1 38.99,76.07 40.39,77.47 50.29,77.47 51.56,76.2 53.09,76.2 54.55,74.74 R80.1 R93.2
N$105
  Top 0.254: C33.1 R24.1 32.96,22.16 33.53,21.59 R36.1
  Top 0.381: JP5.RING 37.42,8.81 36.91,8.81 34.8,10.92 34.8,19.81 34.35,20.26 R36.1
N$115
  Top 0.254: R37.2 R55.2 D1.A 23.37,21.25 C34.1 | U1.P$6 19.82,23.61 20.32,23.11 22.1,23.11 22.8,22.41 C34.1 | D7.C 25.23,24.21 24.89,23.88 24.89,22.86 24.45,22.41 C34.1
N$116
  Top 0.254: U4.2 40.26,74.3 39.37,73.41 38.1,73.41 37.59,72.9 R68.2
N$118
  Top 0.254: U4.3 41.53,74.04 39.62,72.14 R69.2
N$119
  Top 0.254: U4.5 44.07,73.28 43.69,72.9 R73.2
N$120
  Top 0.254: U4.4 42.8,73.79 41.66,72.64 R71.2
N$124
  Top 0.254: U4.6 45.34,73.28 45.72,72.9 R75.2
N$127
  Top 0.254: U4.7 46.61,73.79 47.75,72.64 R77.2
N$128
  Top 0.254: U4.8 47.88,74.04 49.78,72.14 R84.2
N$129
  Top 0.254: U4.9 49.15,74.3 50.04,73.41 51.31,73.41 51.82,72.9 R86.2
N$132
  Top 0.254: R63.2 R62.2 R61.2 R60.2 45.66,55.31 44.96,54.61 34.04,54.61 32.51,53.09 R57.1 31.69,53.91 30.29,55.31 R67.2 R58.1 | R59.1 R66.2
  Top 0.381: R67.2 R66.2 R65.2 R64.2
N$133
  Top 0.508: R78.1 43.18,86.11 46.61,82.68 U4.14
N$134
  Top 0.508: U4.18 41.53,81.41 40.39,82.55 30.73,82.55 28.7,84.58 19.3,84.58 17.78,86.11 R70.1
N$135
  Top 0.508: U4.17 42.8,81.66 40.89,83.57 31.24,83.57 29.21,85.6 20.83,85.6 20.32,86.11 R72.1
N$136
  Top 0.508: U4.16 44.07,81.92 41.4,84.58 31.75,84.58 30.48,85.85 R74.1
N$137
  Top 0.508: U4.15 45.34,82.17 41.91,85.6 33.53,85.6 33.02,86.11 R76.1
N$138
  Top 0.508: U4.13 47.88,83.69 45.72,85.85 R85.1
N$139
  Top 0.508: U4.12 49.15,83.69 51.05,85.6 55.37,85.6 55.88,86.11 R87.1
N$140
  Top 0.508: U4.11 50.42,83.44 51.56,84.58 57.15,84.58 58.42,85.85 R88.1
N$141
  Top 0.508: R78.2 JP12.2
N$142
  Top 0.508: R85.2 JP12.3
N$143
  Top 0.508: R88.2 JP13.3
N$144
  Top 0.508: R188.2 JP23.2
N$145
  Top 0.508: R76.2 JP10.3
N$146
  Top 0.508: R74.2 JP10.2
N$147
  Top 0.508: R72.2 JP9.3
N$148
  Top 0.508: R70.2 JP9.2
N$149
  Top 0.254: U7.1 81.92,76.07 83.06,77.22 95.44,77.22 R155.2 R146.1
N$150
  Top 0.254: R134.2 80.52,72.39 81.28,73.15 82.04,73.15 83.19,74.3 U7.2
N$152
  Top 0.254: R135.2 82.55,72.14 84.45,74.04 U7.3
N$153
  Top 0.254: R139.2 86.61,72.64 87,73.03 U7.5
N$154
  Top 0.254: R137.2 84.58,72.39 85.72,73.53 U7.4
N$158
  Top 0.254: R141.2 88.65,72.64 88.27,73.03 U7.6
N$161
  Top 0.254: R143.2 90.68,72.64 89.53,73.79 U7.7
N$162
  Top 0.254: R147.2 92.71,72.14 90.81,74.04 U7.8
N$163
  Top 0.254: U7.9 92.08,74.04 92.96,73.15 93.98,73.15 94.74,72.39 R149.2
N$166
  Top 0.254: R125.1 R123.1 R124.1 | R124.1 R129.2 | R124.1 47.56,43.5 48.96,44.9 R130.2
  Top 0.381: R133.2 R132.2 R131.2 R130.2 | R129.2 R128.2 R127.2 R126.2
N$167
  Top 0.381: R144.1 93.98,86.11 92.96,85.09 91.44,85.09 89.53,83.19 U7.14
N$168
  Top 0.381: R136.1 68.58,85.85 69.85,84.58 78.49,84.58 80.01,83.06 82.68,83.06 84.45,81.28 U7.18
N$169
  Top 0.381: R138.1 71.12,86.11 71.63,85.6 79.5,85.6 81.03,84.07 83.57,84.07 85.72,81.92 U7.17
N$170
  Top 0.381: R140.1 81.28,85.72 81.92,85.09 84.45,85.09 87,82.55 U7.16
N$171
  Top 0.381: U7.15 88.27,83.19 84.52,86.93 R142.1
N$172
  Top 0.381: R148.1 96.52,86.11 94.49,84.07 92.2,84.07 90.81,82.68 U7.13
N$173
  Top 0.381: R150.1 106.68,86.11 105.92,85.34 97.79,85.34 95.5,83.06 93.22,83.06 92.08,81.92 U7.12
N$174
  Top 0.381: R151.1 109.22,86.11 107.44,84.33 98.55,84.33 96.27,82.04 93.98,82.04 93.34,81.41 U7.11
N$175
  Top 0.508: R144.2 JP18.2
N$176
  Top 0.508: R148.2 JP18.3
N$177
  Top 0.508: R150.2 JP19.2
N$178
  Top 0.508: R151.2 JP19.3
N$179
  Top 0.508: R142.2 JP16.3
N$180
  Top 0.508: R140.2 JP16.2
N$181
  Top 0.508: R138.2 JP15.3
N$182
  Top 0.508: R136.2 JP15.2
N$184
  Top 0.254: U10.2 101.73,73.03 R172.2
N$186
  Top 0.254: U10.3 103,71.75 102.23,70.99 R173.2
N$187
  Top 0.254: U10.5 104.27,69.22 102.23,67.18 R177.2
N$188
  Top 0.254: U10.4 103.5,70.48 102.11,69.09 R175.2
N$192
  Top 0.254: U10.6 104.52,67.94 101.09,64.52 101.09,60.71 101.6,60.2 R179.2
N$195
  Top 0.254: R181.2 103.5,59.82 102.11,61.21 102.11,64.26 104.52,66.67 U10.7
N$196
  Top 0.254: R185.2 105.41,59.69 103.12,61.98 103.12,63.75 104.78,65.41 U10.8
N$197
  Top 0.254: U10.9 104.78,64.14 104.14,63.5 104.14,62.23 105.41,60.96 106.17,60.96 107.31,59.82 R187.2
N$201
  Top 0.381: U10.14 113.67,66.67 116.2,64.14 116.2,60.33 116.84,59.69 R182.1
N$202
  Top 0.381: R174.1 116.2,80.01 114.3,78.11 114.3,73.03 113.03,71.75 U10.18
N$203
  Top 0.381: U10.17 113.67,70.48 115.57,72.39 115.57,76.2 116.84,77.47 R176.1
N$204
  Top 0.381: U10.16 114.94,69.22 115.57,69.85 R178.1
N$205
  Top 0.381: U10.15 114.94,67.94 115.57,67.31 R180.1
N$206
  Top 0.381: U10.13 113.03,65.41 114.94,63.5 114.94,58.8 116.59,57.15 R186.1
N$207
  Top 0.381: U10.12 112.39,64.14 113.67,62.87 113.67,57.78 116.2,55.24 116.2,50.16 116.84,49.53 R188.1
N$208
  Top 0.381: R189.1 116.84,46.99 114.94,48.9 114.94,54.74 112.52,57.15 112.52,61.63 U10.11
N$209
  Top 0.508: R182.2 JP22.2
N$210
  Top 0.508: R186.2 JP22.3
N$211
  Top 0.508: R189.2 JP23.3
N$213
  Top 0.508: R180.2 JP21.3
N$214
  Top 0.508: R178.2 JP21.2
N$216
  Top 0.508: JP20.2 R174.2
RG1
  Top 0.254: U1.P$10 19.82,30.24 22.35,32.77 24.64,32.77 25,32.4 R4.3 25.11,31.56 R8.2
RG2
  Top 0.254: U1.P$1 15.74,27.17 23.34,34.77 R4.2 25.11,34.77 R8.1
VBIAS
  Top 0.254: U1.P$4 14.99,25.41 14.73,25.15 14.73,24.38 15.75,23.37 15.75,21.59 14.73,20.57 C24.1 R2.2 14.16,17.33 14.73,16.76 27.43,16.76 28.26,17.59 R25.2
VCC  (via drill 0.36, 0.51)
  Top 0.254: R5.1 25.91,49.02 25.4,49.53 25.4,52.32 24.64,53.09 24.64,56.07 24.13,56.58 | C50.1 33.53,73.91 34.29,74.68 R79.2 35.37,75.5 37.59,77.72 v37.59,78.49 | 80.87,80.17 79.76,79.06 R145.2 79.19,78.17 78.23,77.22 78.23,75.18 76.58,73.53 C64.1 | 8.95,36.89 R94.2 8.89,37.02 8.57,37.02 8.38,36.83 v8.38,36.07 | R97.2 8.38,28.45 v8.64,28.7 | v10.67,18.8 10.67,20 R99.2 | R162.2 86.17,57.09 v86.11,57.15 | R124.2 49.53,42.42 v51.31,44.2 | R58.2 24.64,56.13 24.19,56.58 24.13,56.58 | C23.1 24.13,56.58 | R44.2 73.21,7.3 75.69,4.83 v75.69,3.05 | C36.1 97.91,17.33 98.04,17.2 | R33.2 17.08,78.17 C1.+ | C22.P$1 52.4,82.37 51.56,81.53 51.56,77.72 52.32,76.96 53.59,76.96 54.42,76.14 R80.2 | R184.2 111,53.85 C4.+ | v97.28,80.26 95.82,80.26 R146.2 | 89.62,17.14 89.86,17.14 C37.P$1 | 89.67,17.2 89.74,17.2 89.92,17.02 C37.P$1 | 89.92,17.27 C37.P$1
  Top 0.381: C72.1 109.22,77.72 108.9,77.41 R183.2 110.49,76.45 110.8,76.76 C71.P$1 | v37.59,78.49 36.78,79.3 C49.P$1 37.85,80.52 38.19,80.17 U4.20 | C13.P$1 20.24,57.48 21.14,56.58 C30.1 C23.1
  Top 0.406: C67.P$2 100,89.23 99.06,90.17 JP18.4
  Top 0.508: U10.20 111.28,74.96 v111.76,75.44 112.01,75.69 C71.P$1 | v80.77,80.26 80.87,80.17 | C38.P$1 C39.P$1 | C39.P$1 C37.P$1 | 89.62,17.14 U3.2 82.93,17.14 82.3,16.51 82.3,15.24 82.74,14.79 R40.2 | U2.20 15.75,62.83 v15.75,60.71 R32.2 | R48.1 v75.69,3.05 | C5.P$1 C8.P$1 C7.P$1 C6.P$1 104.78,12.06 105.68,11.16 J1.PWR | C39.P$1 92.46,15.49 93.62,14.33 L1.P$1
  Top 0.635: U7.20 80.87,80.17 | C11.P$1 C9.P$1 C12.P$1 C10.P$1 | 113.03,12.95 113.54,12.45
  Top 0.762: v15.75,60.71 C29.P$1 15.88,57.48 C13.P$1 | v80.77,80.26 78.41,82.63 C63.P$1 C17.P$1 C16.P$1 C15.P$1 | C38.P$1 98.04,17.2 98.37,17.2 102.18,13.39 C6.P$1
  Top 0.813: C66.P$2 87.3,89.23 86.36,90.17 JP16.4 | C65.P$2 74.6,89.23 73.66,90.17 JP15.4 | C61.P$2 49.2,89.23 48.26,90.17 JP12.4 | C56.P$2 36.5,89.23 35.56,90.17 JP10.4 | C51.P$2 23.8,89.23 22.86,90.17 JP9.4 | C31.P$2 6.04,51.74 5.71,52.07 JP3.4 | JP6.4 6.35,62.23 7.32,61.27 C43.P$2 | JP7.4 5.71,72.39 7.32,70.79 C47.P$2 | JP8.4 5.08,82.55 7.32,80.31 C48.P$2 | C73.P$2 120.83,75.26 121.16,74.93 JP20.4 | C74.P$2 120.83,65.1 121.16,64.77 JP21.4 | C75.P$2 120.83,54.94 121.16,54.61 JP22.4 | C76.P$2 JP23.4 | C70.P$2 112.39,91.44 JP19.4
  Top 0.889: C22.P$1 C21.P$1 C20.P$1 60.38,82.37 60.71,82.04 C18.P$1
  Top 1.016: JP13.4 60.96,90.17 61.65,89.48 C62.P$2 C19.P$1 C18.P$1
  Top 1.27: 113.03,12.95 C3.+
  pour Route15 (isolate 0.711): 0.64,94.49 126.49,94.49 126.49,0.64 0.64,0.64
  pour Top (isolate 0.711): 101.85,1.02 125.98,1.02 125.98,13.97 101.85,13.97
VPP  (via drill 0.36)
  Top 0.254: R23.2 v30.61,22.86 R24.2 | v36.58,18.54 45.97,18.54 52.32,12.19 68.33,12.19 | 68.33,12.19 72.39,12.19 74.23,10.35 C42.1 | R43.2 68.33,12.19
  Top 0.381: C42.1 76.14,10.35 v76.96,11.18
  Top 0.508: v76.96,11.18 77.04,11.25 C41.P$1 C40.P$1 82.98,11.25 83.65,10.58 D3.C | C42.1 75.18,11.94 75.63,12.38 R41.2
  Bottom 0.254: v30.61,22.86 32.26,22.86 v36.58,18.54

## Text on the board
tPlace: SoundPuddle | Papilio | MegaWing | U7 | RN-41 | Bluetooth | Module | Aux | Phantom Power | Sel | Enable | Vpp | MIDI | 3.3V | Vin | 5V | Rev 1 | 08-2012 | Power In